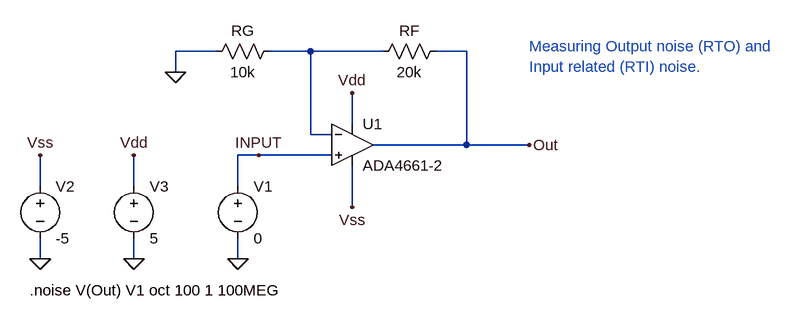
[diagram p0: schematic ADA4661.asc]
ADA4661.asc, the LTspice schematic file:
Version 4
SHEET 1 892 680
WIRE 0 16 -64 16
WIRE 144 16 80 16
WIRE 256 16 144 16
WIRE 384 16 336 16
WIRE -64 48 -64 16
WIRE 208 128 208 80
WIRE 144 144 144 16
WIRE 176 144 144 144
WIRE 384 160 384 16
WIRE 384 160 240 160
WIRE 480 160 384 160
WIRE 64 176 32 176
WIRE 176 176 64 176
WIRE -272 224 -272 176
WIRE -128 224 -128 176
WIRE 32 224 32 176
WIRE 208 256 208 192
WIRE -272 336 -272 304
WIRE -128 336 -128 304
WIRE 32 336 32 304
FLAG -64 48 0
FLAG 32 336 0
FLAG -128 336 0
FLAG -272 336 0
FLAG 208 80 Vdd
FLAG -128 176 Vdd
FLAG 208 256 Vss
FLAG -272 176 Vss
FLAG 480 160 Out
FLAG 64 176 INPUT
SYMBOL OpAmps\\ADA4661-2 208 96 R0
SYMATTR InstName U1
SYMBOL res 352 0 R90
WINDOW 0 0 56 VBottom 2
WINDOW 3 32 56 VTop 2
SYMATTR InstName RF
SYMATTR Value 20k
SYMBOL res 96 0 R90
WINDOW 0 0 56 VBottom 2
WINDOW 3 32 56 VTop 2
SYMATTR InstName RG
SYMATTR Value 10k
SYMBOL voltage 32 208 R0
WINDOW 123 0 0 Left 0
WINDOW 39 0 0 Left 0
SYMATTR InstName V1
SYMATTR Value 0
SYMBOL voltage -272 208 R0
WINDOW 123 0 0 Left 0
WINDOW 39 0 0 Left 0
SYMATTR InstName V2
SYMATTR Value -5
SYMBOL voltage -128 208 R0
WINDOW 123 0 0 Left 0
WINDOW 39 0 0 Left 0
SYMATTR InstName V3
SYMATTR Value 5
TEXT -288 384 Left 2 !.noise V(Out) V1 oct 100 1 100MEG
TEXT 480 8 Left 2 ;Measuring Output noise (RTO) and \nInput related (RTI) noise.

The netlist it stands for:
* ADA4661.asc
XU1 INPUT N001 Vdd Vss Out ADA4661-2  ; pins In+ In- V+ V- OUT
RF Out N001 20k
RG N001 0 10k
V1 INPUT 0 0
V2 Vss 0 -5
V3 Vdd 0 5
.noise V(Out) V1 oct 100 1 100MEG
* Measuring Output noise (RTO) and
* Input related (RTI) noise.
.lib ADI1.lib
.backanno
.end